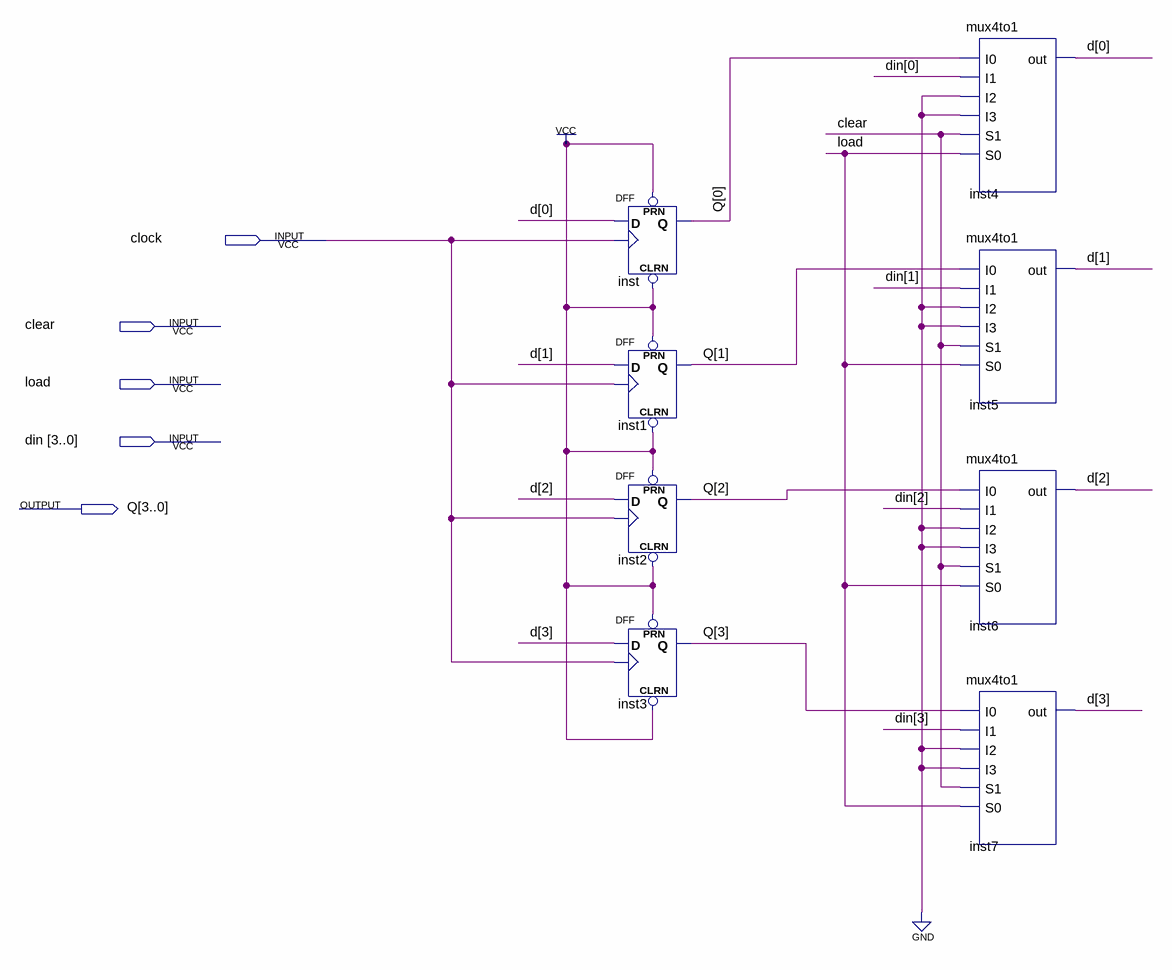
[diagram p0: schematic sheet]
// Quartus schematic Register4bits.bdf as structural Verilog: 8 symbols, 5 pins
module Register4bits (
  input  clock,
  input  clear,
  input  load,
  input  [3:0] din,
  output [3:0] Q
);

  wire [3:0] d;

  DFF inst (.CLRN(1'b1), .CLK(clock), .D(d[0]), .PRN(1'b1), .Q(Q[0]));
  DFF inst1 (.CLRN(1'b1), .CLK(clock), .D(d[1]), .PRN(1'b1), .Q(Q[1]));
  DFF inst2 (.CLRN(1'b1), .CLK(clock), .D(d[2]), .PRN(1'b1), .Q(Q[2]));
  DFF inst3 (.CLRN(1'b1), .CLK(clock), .D(d[3]), .PRN(1'b1), .Q(Q[3]));
  mux4to1 inst4 (.I0(Q[0]), .I1(din[0]), .I2(1'b0), .I3(1'b0), .S1(clear), .S0(load), .out(d[0]));
  mux4to1 inst5 (.I0(Q[1]), .I1(din[1]), .I2(1'b0), .I3(1'b0), .S1(clear), .S0(load), .out(d[1]));
  mux4to1 inst6 (.I0(Q[2]), .I1(din[2]), .I2(1'b0), .I3(1'b0), .S1(clear), .S0(load), .out(d[2]));
  mux4to1 inst7 (.I0(Q[3]), .I1(din[3]), .I2(1'b0), .I3(1'b0), .S1(clear), .S0(load), .out(d[3]));
endmodule
